# Altium project POWER_SUPPLY.PrjPcb (part 7 of 8)
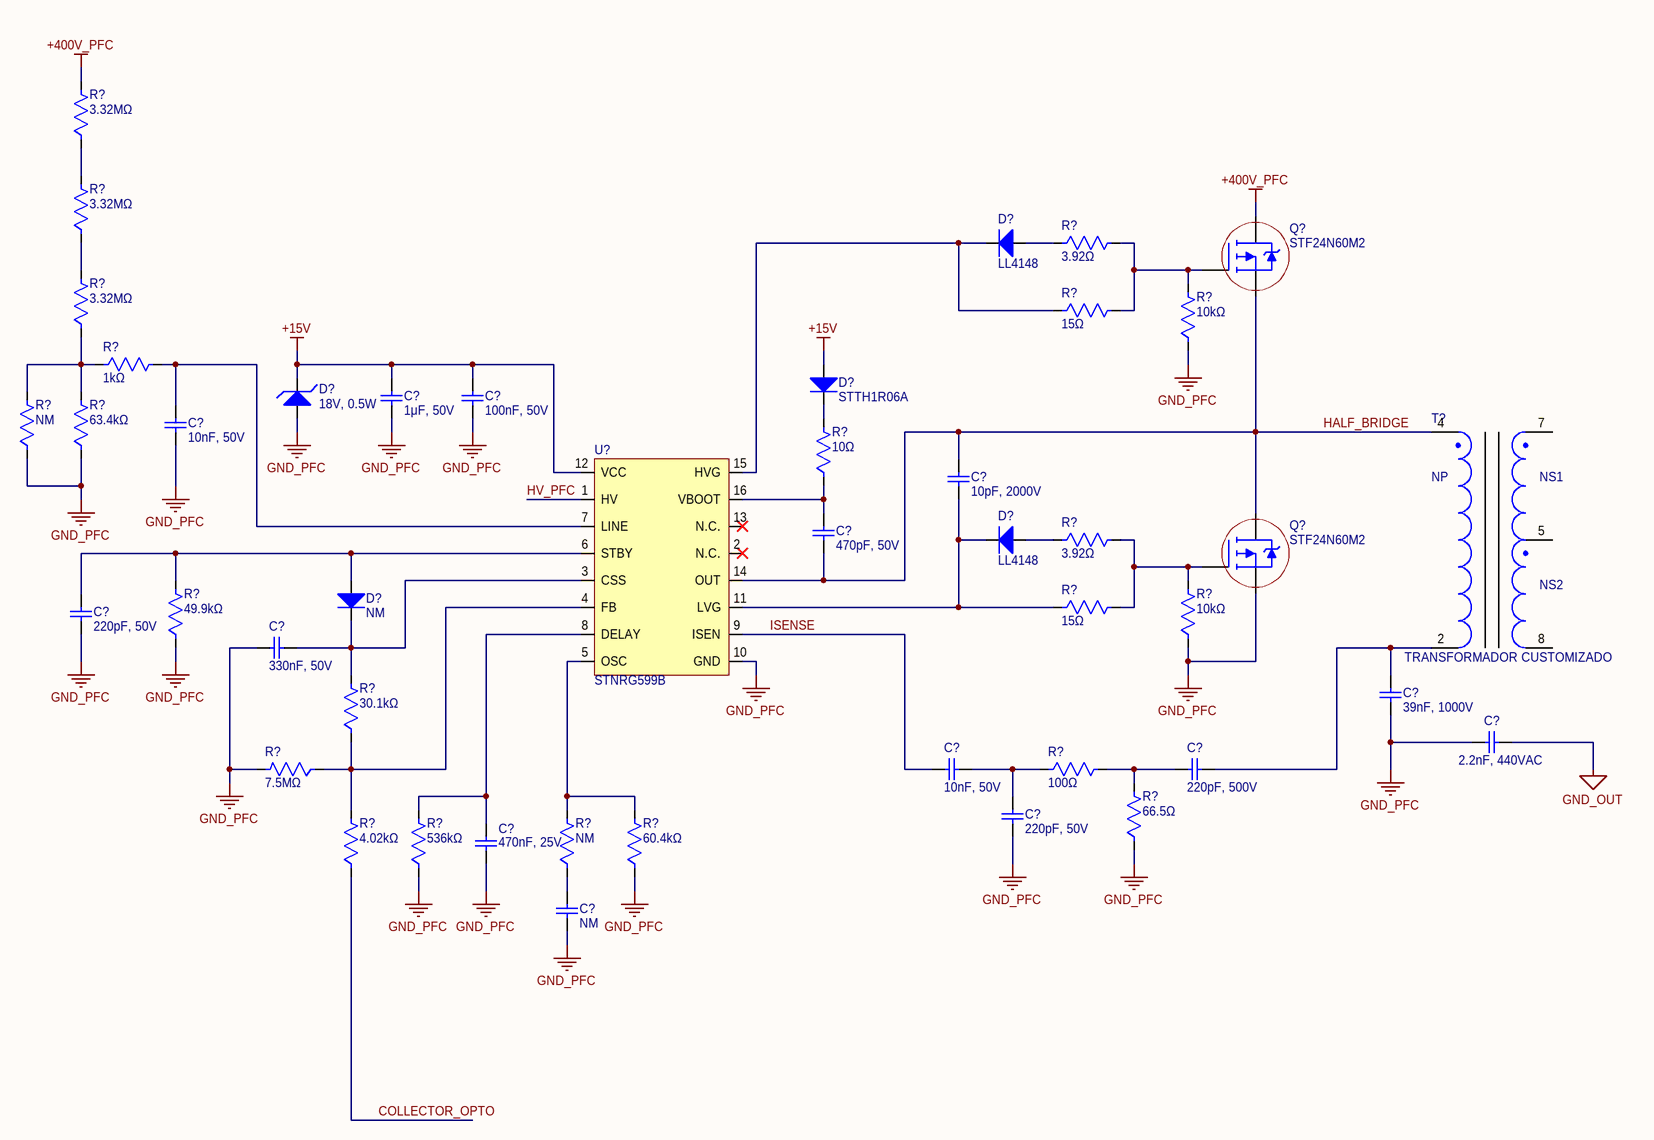
[diagram p8: 3_LLC.SchDoc]

## Sheet 3_LLC.SchDoc (continued)
### Library data of the parts
C?#1 = 885012206126: WCAP-CSGP Multilayer Ceramic Chip Capacitor, General Purpose, size 0603, 1μF, 50V; Manufacturer: Wurth Elektronik; Case/Size Code: 0603; Capacitance Tolerance: +/-10%; Ceramic Type: X7R; Dissipation Factor: 10%; Insulation Resistance: 0.5GΩ; Technical Reference: X7R0603105K050DFCT10000; Manufacturer Part Number: 885012206126; Category: Multilayer Ceramic Chip Capacitors; Match Code: WCAP-CSGP; ComponentLink1Description: Website Link; ComponentLink1URL: https://www.we-online.com/redexpert/article/885012206126?ad; ComponentLink2Description: Datasheet Link; ComponentLink2URL: https://www.we-online.com/redexpert/spec/885012206126?ad; Mount: Surface Mount; Min Operating Temperature: -55°C; Max Operating Temperature: 125°C; Packaging: Tape and Reel; Length: 1.6mm; Width: 0.8mm; Height: 0.8mm; Capacitance: 1μF; Rated Voltage (DC): 50V
C?#2 C?#14 = 885012206095R: WCAP-CSGP Multilayer Ceramic Chip Capacitor, General Purpose, size 0603, 100nF, 50V; Manufacturer: Wurth Elektronik; Case/Size Code: 0603; Capacitance Tolerance: +/-10%; Ceramic Type: X7R; Dissipation Factor: 3%; Insulation Resistance: 5GΩ; Technical Reference: X7R0603104K050DFCT20000; Manufacturer Part Number: 885012206095R; Category: Multilayer Ceramic Chip Capacitors; Match Code: WCAP-CSGP; ComponentLink1Description: Website Link; ComponentLink1URL: https://www.we-online.com/redexpert/article/885012206095R?ad; ComponentLink2Description: Datasheet Link; ComponentLink2URL: https://www.we-online.com/redexpert/spec/885012206095R?ad; Mount: Surface Mount; Min Operating Temperature: -55°C; Max Operating Temperature: 125°C; Packaging: Tape and Reel; Length: 1.6mm; Width: 0.8mm; Height: 0.8mm; Capacitance: 100nF; Rated Voltage (DC): 50V
C?#3 = 885012206089: WCAP-CSGP Multilayer Ceramic Chip Capacitor, General Purpose, size 0603, 10nF, 50V; Manufacturer: Wurth Elektronik; Case/Size Code: 0603; Capacitance Tolerance: +/-10%; Ceramic Type: X7R; Dissipation Factor: 2.5%; Insulation Resistance: 10Gohm; Technical Reference: X7R0603103K050DFCT10000; Manufacturer Part Number: 885012206089; Product Series: WCAP-CSGP; ComponentLink1Description: Website Link; ComponentLink1URL: https://www.we-online.com/redexpert/article/885012206089?ad; ComponentLink2Description: Datasheet Link; ComponentLink2URL: https://www.we-online.com/redexpert/spec/885012206089?ad; Mount: Surface Mount; Operating Temperature Min: -55degC; Operating Temperature Max: 125degC; Packaging: Tape and Reel; Length: 1.6mm; Width: 0.8mm; Height: 0.8mm; Capacitance: 10nF; Rated Voltage (DC): 50V
C?#4 = 885342009004: WCAP-CSMH Multilayer Ceramic Chip Capacitor Mid and High Voltage, SMT, size 1210, NP0 Class I, 10pF, 2000V; Manufacturer: Wurth Elektronik; Case/Size Code: 1210; Capacitance Tolerance: +/-5%; Insulation Resistance: 10Gohm; Q Factor Min: 600; Manufacturer Part Number: 885342009004; Product Series: WCAP-CSMH; ComponentLink1Description: Website Link; ComponentLink1URL: https://www.we-online.com/redexpert/article/885342009004?ad; ComponentLink2Description: Datasheet Link; ComponentLink2URL: https://www.we-online.com/redexpert/spec/885342009004?ad; Mount: Surface Mount; Operating Temperature Min: -55degC; Operating Temperature Max: 125degC; Packaging: Tape and Reel; Length: 3.2mm; Width: 2.5mm; Height: 0.95mm; Capacitance: 10pF; Ceramic Type: NP0 Class I; Rated Voltage (DC): 2000V
C?#5 = 885012006061: WCAP-CSGP Multilayer Ceramic Chip Capacitor, General Purpose, size 0603, 470pF, 50V; Manufacturer: Wurth Elektronik; Case/Size Code: 0603; Capacitance Tolerance: +/-5%; Ceramic Type: NP0; Insulation Resistance: 10Gohm; Q Factor: 1000; Technical Reference: NP00603471J050DFCT10000; Manufacturer Part Number: 885012006061; Product Series: WCAP-CSGP; ComponentLink1Description: Website Link; ComponentLink1URL: https://www.we-online.com/redexpert/article/885012006061?ad; ComponentLink2Description: Datasheet Link; ComponentLink2URL: https://www.we-online.com/redexpert/spec/885012006061?ad; Mount: Surface Mount; Operating Temperature Min: -55degC; Operating Temperature Max: 125degC; Packaging: Tape and Reel; Length: 1.6mm; Width: 0.8mm; Height: 0.8mm; Capacitance: 470pF; Rated Voltage (DC): 50V
C?#6 C?#12 = 885012006059: WCAP-CSGP Multilayer Ceramic Chip Capacitor, General Purpose, size 0603, 220pF, 50V; Manufacturer: Wurth Elektronik; Case/Size Code: 0603; Capacitance Tolerance: +/-5%; Ceramic Type: NP0; Insulation Resistance: 10Gohm; Q Factor: 1000; Technical Reference: NP00603221J050DFCT10000; Manufacturer Part Number: 885012006059; Product Series: WCAP-CSGP; ComponentLink1Description: Website Link; ComponentLink1URL: https://www.we-online.com/redexpert/article/885012006059?ad; ComponentLink2Description: Datasheet Link; ComponentLink2URL: https://www.we-online.com/redexpert/spec/885012006059?ad; Mount: Surface Mount; Operating Temperature Min: -55degC; Operating Temperature Max: 125degC; Packaging: Tape and Reel; Length: 1.6mm; Width: 0.8mm; Height: 0.8mm; Capacitance: 220pF; Rated Voltage (DC): 50V
C?#7 = 885012206121: WCAP-CSGP Multilayer Ceramic Chip Capacitor, General Purpose, size 0603, 330nF, 50V; Manufacturer: Wurth Elektronik; Case/Size Code: 0603; Capacitance Tolerance: +/-10%; Ceramic Type: X7R; Dissipation Factor: 10%; Insulation Resistance: 1.5Gohm; Technical Reference: X7R0603334K050DFCT10000; Manufacturer Part Number: 885012206121; Product Series: WCAP-CSGP; ComponentLink1Description: Website Link; ComponentLink1URL: https://www.we-online.com/redexpert/article/885012206121?ad; ComponentLink2Description: Datasheet Link; ComponentLink2URL: https://www.we-online.com/redexpert/spec/885012206121?ad; Mount: Surface Mount; Operating Temperature Min: -55degC; Operating Temperature Max: 125degC; Packaging: Tape and Reel; Length: 1.6mm; Width: 0.8mm; Height: 0.8mm; Capacitance: 330nF; Rated Voltage (DC): 50V
C?#8 = 76QI2390SE40J: CAP FILM AUTO POLYPROP RAD; Manufacturer: Yageo Group; Dielectric: PP; Dielectric Material: Polypropylene; Lead Diameter: 800µm; Tolerance: 5%; Voltage Rating (AC): 600V; Voltage Rating (DC): 1kV; Supplier: DigiKey; Supplier Part Number: 399-R76QI2390SE40J-ND; Manufacturer Part Number: 76QI2390SE40J; RoHS: Compliant; Category: Film Capacitors; Stock: 469; Pricing: 1=1.27, 10=0.83, 50=0.6542, 100=0.5999, 500=0.5083, 1000=0.47996, 3000=0.44494, 5000=0.43198 (USD); Value: 39nF; Case/Package: Radial; Depth: 8.5mm; Export Control Classification Number (ECCN) Code: EAR99; Height: 14.5mm; Harmonized Tariff Schedule (HTS) Code: 8532.25.00.70; Introduction Date: 2012-07-30; Lead Pitch: 15mm; Length: 18mm; Lifecycle Status: Production; Max Operating Temperature: 110°C; Min Operating Temperature: -55°C; Mounting Technology: Through Hole; Number of Terminals: 2; Packaging: Bulk; Radiation Hardening: No; Ratings: AEC-Q200; REACH SVHC: Unaffected; Terminal Pitch: 15mm; Width: 8.5mm; ComponentLink1URL: https://datasheet.octopart.com:443/76QI2390SE40J-KEMET-datasheet-182036333.pdf?src-supplier=IHS; ComponentLink1Description: https://datasheet.octopart.com:443/76QI2390SE40J-KEMET-datasheet-182036333.pdf?src-supplier=IHS
C?#9 = VY2222M35Y5US63V7: CAP CER 2200PF 440VAC Y5U RADIAL; Manufacturer: Vishay; Dielectric Material: Ceramic; Lead/Base Style: Kinked; Lead Diameter: 600µm; Lead Length: 30mm; Tolerance: 20%; Voltage: 250V; Voltage Rating: 1kV; Voltage Rating (AC): 300V; Supplier: DigiKey; Supplier Part Number: BC2356-ND; Manufacturer Part Number: VY2222M35Y5US63V7; RoHS: Compliant; Category: Ceramic Capacitors; Stock: 12709; Pricing: 1=0.48, 10=0.288, 50=0.2152, 100=0.1928, 500=0.15486, 1000=0.14314, 3000=0.12868, 5000=0.12334 (USD); Value: 2.2nF; Case/Package: Radial; Composition: Ceramic; Contact Plating: Tin; Depth: 5mm; Diameter: 9mm; Dielectric: Y5U; Export Control Classification Number (ECCN) Code: EAR99; Height: 9mm; Height - Seated (Max): 13.0048mm; Harmonized Tariff Schedule (HTS) Code: 8532.23.00.60; Lead Free: Lead Free; Lead Pitch: 7.5mm; Length: 9mm; Lifecycle Status: Production; Material: Ceramic; Max Operating Temperature: 125°C; Min Operating Temperature: -40°C; Mounting Technology: PCB, Through Hole; Number of Terminals: 2; Packaging: Bulk; Radiation Hardening: No; REACH SVHC: Yes; Schedule B: 8532230060, 8532230060|8532230060, 8532230060|8532230060|8532230060, 8532230060|8532230060|8532230060|8532230060; Terminal Pitch: 7.5mm; Termination: Radial; Voltage Rating (DC): 1kV; Width: 5mm; ComponentLink1URL: https://datasheet.octopart.com:443/VY2222M35Y5US63V7-Vishay-datasheet-182139072.pdf?src-supplier=IHS; ComponentLink1Description: https://datasheet.octopart.com:443/VY2222M35Y5US63V7-Vishay-datasheet-182139072.pdf?src-supplier=IHS; ComponentLink2URL: https://datasheet.octopart.com:443/VY2222M35Y5US63V7-Vishay-datasheet-182137621.pdf?src-supplier=IHS; ComponentLink2Description: https://datasheet.octopart.com:443/VY2222M35Y5US63V7-Vishay-datasheet-182137621.pdf?src-supplier=IHS; ComponentLink3URL: https://datasheet.octopart.com:443/VY2222M35Y5US63V7-Vishay-BCcomponents-datasheet-138899136.pdf?src-supplier=Upverter; ComponentLink3Description: https://datasheet.octopart.com:443/VY2222M35Y5US63V7-Vishay-BCcomponents-datasheet-138899136.pdf?src-supplier=Upverter; ComponentLink4URL: https://datasheet.octopart.com:443/VY2222M35Y5US63V7-Vishay-datasheet-62321353.pdf?src-supplier=Farnell; ComponentLink4Description: https://datasheet.octopart.com:443/VY2222M35Y5US63V7-Vishay-datasheet-62321353.pdf?src-supplier=Farnell; ComponentLink5URL: https://datasheet.octopart.com:443/VY2222M35Y5US63V7-Vishay-datasheet-15070738.pdf?src-supplier=Farnell; ComponentLink5Description: https://datasheet.octopart.com:443/VY2222M35Y5US63V7-Vishay-datasheet-15070738.pdf?src-supplier=Farnell; ComponentLink6URL: https://datasheet.octopart.com:443/VY2222M35Y5US63V7-Vishay-datasheet-10380040.pdf?src-supplier=element14+APAC; ComponentLink6Description: https://datasheet.octopart.com:443/VY2222M35Y5US63V7-Vishay-datasheet-10380040.pdf?src-supplier=element14+APAC; ComponentLink7URL: https://datasheet.octopart.com:443/VY2222M35Y5US63V7-Vishay-datasheet-13530909.pdf?src-supplier=Future+Electronics; ComponentLink7Description: https://datasheet.octopart.com:443/VY2222M35Y5US63V7-Vishay-datasheet-13530909.pdf?src-supplier=Future+Electronics; ComponentLink8URL: https://datasheet.octopart.com:443/VY2222M35Y5US63V7-Vishay-datasheet-13402494.pdf?src-supplier=Future+Electronics; ComponentLink8Description: https://datasheet.octopart.com:443/VY2222M35Y5US63V7-Vishay-datasheet-13402494.pdf?src-supplier=Future+Electronics; ComponentLink9URL: https://datasheet.octopart.com:443/VY2222M35Y5US63V7-Vishay-datasheet-13168647.pdf?src-supplier=Future+Electronics; ComponentLink9Description: https://datasheet.octopart.com:443/VY2222M35Y5US63V7-Vishay-datasheet-13168647.pdf?src-supplier=Future+Electronics; ComponentLink10URL: https://datasheet.octopart.com:443/VY2222M35Y5US63V7-Vishay-datasheet-13030022.pdf?src-supplier=Future+Electronics; ComponentLink10Description: https://datasheet.octopart.com:443/VY2222M35Y5US63V7-Vishay-datasheet-13030022.pdf?src-supplier=Future+Electronics; ComponentLink11URL: https://datasheet.octopart.com:443/VY2222M35Y5US63V7-Vishay-datasheet-12553972.pdf?src-supplier=Future+Electronics; ComponentLink11Description: https://datasheet.octopart.com:443/VY2222M35Y5US63V7-Vishay-datasheet-12553972.pdf?src-supplier=Future+Electronics; ComponentLink12URL: https://datasheet.octopart.com:443/VY2222M35Y5US63V7-Vishay-datasheet-12524127.pdf?src-supplier=Future+Electronics; ComponentLink12Description: https://datasheet.octopart.com:443/VY2222M35Y5US63V7-Vishay-datasheet-12524127.pdf?src-supplier=Future+Electronics; ComponentLink13URL: https://datasheet.octopart.com:443/VY2222M35Y5US63V7-Vishay-datasheet-12510687.pdf?src-supplier=Future+Electronics; ComponentLink13Description: https://datasheet.octopart.com:443/VY2222M35Y5US63V7-Vishay-datasheet-12510687.pdf?src-supplier=Future+Electronics; ComponentLink14URL: https://datasheet.octopart.com:443/VY2222M35Y5US63V7-Vishay-datasheet-27584505.pdf?src-supplier=Future+Electronics; ComponentLink14Description: https://datasheet.octopart.com:443/VY2222M35Y5US63V7-Vishay-datasheet-27584505.pdf?src-supplier=Future+Electronics; ComponentLink15URL: https://datasheet.octopart.com:443/VY2222M35Y5US63V7-Vishay-datasheet-9918016.pdf?src-supplier=RS+(Formerly+Allied+Electronics); ComponentLink15Description: https://datasheet.octopart.com:443/VY2222M35Y5US63V7-Vishay-datasheet-9918016.pdf?src-supplier=RS+(Formerly+Allied+Electronics); ComponentLink16URL: http://sigma.octopart.com:80/rohs_statement/Vishay-company-15.pdf?src-supplier=Compliance+Statements; ComponentLink16Description: http://sigma.octopart.com:80/rohs_statement/Vishay-company-15.pdf?src-supplier=Compliance+Statements
C?#10 = 885012207092: WCAP-CSGP Multilayer Ceramic Chip Capacitor, General Purpose, size 0805, 10nF, 50V; Manufacturer: Wurth Elektronik; Case/Size Code: 0805; Capacitance Tolerance: +/-10%; Ceramic Type: X7R; Dissipation Factor: 2.5%; Insulation Resistance: 10Gohm; Technical Reference: X7R0805103K050DFCT10000; Manufacturer Part Number: 885012207092; Product Series: WCAP-CSGP; ComponentLink1Description: Website Link; ComponentLink1URL: https://www.we-online.com/redexpert/article/885012207092?ad; ComponentLink2Description: Datasheet Link; ComponentLink2URL: https://www.we-online.com/redexpert/spec/885012207092?ad; Mount: Surface Mount; Operating Temperature Min: -55degC; Operating Temperature Max: 125degC; Packaging: Tape and Reel; Length: 2mm; Width: 1.25mm; Height: 0.8mm; Capacitance: 10nF; Rated Voltage (DC): 50V
C?#11 = 885342008002: WCAP-CSMH Multilayer Ceramic Chip Capacitor Mid and High Voltage, SMT, size 1206, NP0 Class I, 220pF, 500V; Manufacturer: Wurth Elektronik; Case/Size Code: 1206; Capacitance Tolerance: +/-5%; Insulation Resistance: 10Gohm; Q Factor Min: 1000; Manufacturer Part Number: 885342008002; Product Series: WCAP-CSMH; ComponentLink1Description: Website Link; ComponentLink1URL: https://www.we-online.com/redexpert/article/885342008002?ad; ComponentLink2Description: Datasheet Link; ComponentLink2URL: https://www.we-online.com/redexpert/spec/885342008002?ad; Mount: Surface Mount; Operating Temperature Min: -55degC; Operating Temperature Max: 125degC; Packaging: Tape and Reel; Length: 3.2mm; Width: 1.6mm; Height: 0.8mm; Capacitance: 220pF; Ceramic Type: NP0 Class I; Rated Voltage (DC): 500V
C?#13 = 885012206075: WCAP-CSGP Multilayer Ceramic Chip Capacitor, General Purpose, size 0603, 470nF, 25V; Manufacturer: Wurth Elektronik; Case/Size Code: 0603; Capacitance Tolerance: +/-10%; Ceramic Type: X7R; Dissipation Factor: 10%; Insulation Resistance: 1.1Gohm; Technical Reference: X7R0603474K025DFCT10000; Manufacturer Part Number: 885012206075; Product Series: WCAP-CSGP; ComponentLink1Description: Website Link; ComponentLink1URL: https://www.we-online.com/redexpert/article/885012206075?ad; ComponentLink2Description: Datasheet Link; ComponentLink2URL: https://www.we-online.com/redexpert/spec/885012206075?ad; Mount: Surface Mount; Operating Temperature Min: -55degC; Operating Temperature Max: 125degC; Packaging: Tape and Reel; Length: 1.6mm; Width: 0.8mm; Height: 0.8mm; Capacitance: 470nF; Rated Voltage (DC): 25V
D?#1 D?#4 D?#5 = LL4148: DIODE STANDARD 100V 200MA SOD80; Manufacturer: onsemi; Manufacturer Lifecycle Status: ACTIVE; Body Material: Glass; Current: 2A; Element Configuration: Single; Forward Voltage: 1V; Max Power Dissipation: 500mW; Number of Elements: 1; Peak Reverse Current: 25nA; Recovery Time: 4ns; Supplier: DigiKey; Supplier Part Number: LL4148FSCT-ND; Manufacturer Part Number: LL4148; RoHS: Compliant; Category: Rectifier Diodes; Stock: 985538; Pricing: 1=0.1, 10=0.05, 100=0.0426, 500=0.0307, 1000=0.02682 (USD); Average Rectified Current: 200mA; China RoHS: Non-Compliant; Contact Plating: Tin; Country of Origin: Mainland China; Export Control Classification Number (ECCN) Code: EAR99; Forward Current: 200mA; Height: 1.5mm; Harmonized Tariff Schedule (HTS) Code: 8541.10.00.70; Introduction Date: 2006-01-13; Lead Free: Lead Free; Length: 3.6mm; Lifecycle Status: Production; Max Forward Surge Current (Ifsm): 2A; Max Operating Temperature: 175°C; Max Output current: 200mA; Max Repetitive Reverse Voltage (Vrrm): 100V; Max Reverse Voltage (DC): 100V; Max Surge Current: 2A; Min Operating Temperature: -55°C; Mounting Technology: Surface Mount; Pins: 2; Number of Terminals: 2; Packaging: Cut Tape; Peak Non-Repetitive Surge Current: 2A; Power Dissipation: 500mW; Radiation Hardening: No; REACH SVHC: Yes; Reverse Recovery Time: 4ns; Reverse Standoff Voltage: 100V; Reverse Voltage: 100V; Schedule B: 8541100070, 8541100070|8541100070, 8541100070|8541100070|8541100070, 8541100070|8541100070|8541100070|8541100070; Voltage: 100V; Weight: 4.535924g; Width: 1.5mm; ComponentLink1URL: https://datasheet.octopart.com:443/LL4148-onsemi-datasheet-158584874.pdf?src-supplier=onsemi; ComponentLink1Description: https://datasheet.octopart.com:443/LL4148-onsemi-datasheet-158584874.pdf?src-supplier=onsemi; ComponentLink2URL: https://datasheet.octopart.com:443/LL4148-ON-Semiconductor-datasheet-85572496.pdf?src-supplier=onsemi; ComponentLink2Description: https://datasheet.octopart.com:443/LL4148-ON-Semiconductor-datasheet-85572496.pdf?src-supplier=onsemi; ComponentLink3URL: https://datasheet.octopart.com:443/LL4148-ON-Semiconductor-datasheet-86697764.pdf?src-supplier=onsemi; ComponentLink3Description: https://datasheet.octopart.com:443/LL4148-ON-Semiconductor-datasheet-86697764.pdf?src-supplier=onsemi; ComponentLink4URL: https://datasheet.octopart.com:443/LL4148-ON-Semiconductor-datasheet-17172799.pdf?src-supplier=element14+APAC; ComponentLink4Description: https://datasheet.octopart.com:443/LL4148-ON-Semiconductor-datasheet-17172799.pdf?src-supplier=element14+APAC; ComponentLink5URL: https://datasheet.octopart.com:443/LL4148-ON-Semiconductor-datasheet-86691521.pdf?src-supplier=element14+APAC; ComponentLink5Description: https://datasheet.octopart.com:443/LL4148-ON-Semiconductor-datasheet-86691521.pdf?src-supplier=element14+APAC; ComponentLink6URL: https://datasheet.octopart.com:443/LL4148-Fairchild-Semiconductor-datasheet-38581097.pdf?src-supplier=element14+APAC; ComponentLink6Description: https://datasheet.octopart.com:443/LL4148-Fairchild-Semiconductor-datasheet-38581097.pdf?src-supplier=element14+APAC; ComponentLink7URL: https://datasheet.octopart.com:443/LL4148-Fairchild-Semiconductor-datasheet-62114946.pdf?src-supplier=element14+APAC; ComponentLink7Description: https://datasheet.octopart.com:443/LL4148-Fairchild-Semiconductor-datasheet-62114946.pdf?src-supplier=element14+APAC; ComponentLink8URL: https://datasheet.octopart.com:443/LL4148-Fairchild-Semiconductor-datasheet-62292353.pdf?src-supplier=element14+APAC; ComponentLink8Description: https://datasheet.octopart.com:443/LL4148-Fairchild-Semiconductor-datasheet-62292353.pdf?src-supplier=element14+APAC; ComponentLink9URL: https://datasheet.octopart.com:443/LL4148.-ON-Semiconductor-datasheet-87455466.pdf?src-supplier=element14+APAC; ComponentLink9Description: https://datasheet.octopart.com:443/LL4148.-ON-Semiconductor-datasheet-87455466.pdf?src-supplier=element14+APAC; ComponentLink10URL: https://datasheet.octopart.com:443/LL4148-ON-Semiconductor-datasheet-100088444.pdf?src-supplier=JRH+Electronics; ComponentLink10Description: https://datasheet.octopart.com:443/LL4148-ON-Semiconductor-datasheet-100088444.pdf?src-supplier=JRH+Electronics; ComponentLink11URL: https://datasheet.octopart.com:443/LL4148-onsemi-datasheet-180961323.pdf?src-supplier=IHS; ComponentLink11Description: https://datasheet.octopart.com:443/LL4148-onsemi-datasheet-180961323.pdf?src-supplier=IHS; ComponentLink12URL: https://datasheet.octopart.com:443/LL4148-Fairchild-Semiconductor-datasheet-182297807.pdf?src-supplier=IHS; ComponentLink12Description: https://datasheet.octopart.com:443/LL4148-Fairchild-Semiconductor-datasheet-182297807.pdf?src-supplier=IHS; ComponentLink13URL: https://datasheet.octopart.com:443/LL4148-Fairchild-datasheet-492438.pdf?src-supplier=Fairchild+Semiconductor; ComponentLink13Description: https://datasheet.octopart.com:443/LL4148-Fairchild-datasheet-492438.pdf?src-supplier=Fairchild+Semiconductor; ComponentLink14URL: https://datasheet.octopart.com:443/LL4148-Fairchild-Semiconductor-datasheet-11045226.pdf?src-supplier=Fairchild+Semiconductor; ComponentLink14Description: https://datasheet.octopart.com:443/LL4148-Fairchild-Semiconductor-datasheet-11045226.pdf?src-supplier=Fairchild+Semiconductor; ComponentLink15URL: https://sigma.octopart.com:443/17344539/technical_drawing/Fairchild-Semiconductor-LL4148.pdf?src-supplier=Fairchild+Semiconductor; ComponentLink15Description: https://sigma.octopart.com:443/17344539/technical_drawing/Fairchild-Semiconductor-LL4148.pdf?src-supplier=Fairchild+Semiconductor; ComponentLink16URL: https://datasheet.octopart.com:443/LL4148-Fairchild-Semiconductor-datasheet-14041796.pdf?src-supplier=iiiC; ComponentLink16Description: https://datasheet.octopart.com:443/LL4148-Fairchild-Semiconductor-datasheet-14041796.pdf?src-supplier=iiiC; ComponentLink17URL: https://datasheet.octopart.com:443/LL4148-Fairchild-Semiconductor-datasheet-10438456.pdf?src-supplier=Jameco; ComponentLink17Description: https://datasheet.octopart.com:443/LL4148-Fairchild-Semiconductor-datasheet-10438456.pdf?src-supplier=Jameco; ComponentLink18URL: https://datasheet.octopart.com:443/LL4148-ON-Semiconductor-datasheet-81454985.pdf?src-supplier=TME; ComponentLink18Description: https://datasheet.octopart.com:443/LL4148-ON-Semiconductor-datasheet-81454985.pdf?src-supplier=TME; ComponentLink19URL: https://datasheet.octopart.com:443/LL4148-Fairchild-Semiconductor-datasheet-62139678.pdf?src-supplier=iodParts+Technologies+Inc.; ComponentLink19Description: https://datasheet.octopart.com:443/LL4148-Fairchild-Semiconductor-datasheet-62139678.pdf?src-supplier=iodParts+Technologies+Inc.; ComponentLink20URL: https://datasheet.octopart.com:443/LL4148-Fairchild-Semiconductor-datasheet-62268912.pdf?src-supplier=Newark; ComponentLink20Description: https://datasheet.octopart.com:443/LL4148-Fairchild-Semiconductor-datasheet-62268912.pdf?src-supplier=Newark; ComponentLink21URL: http://sigma.octopart.com:80/150613095/rohs_statement/ON-Semiconductor-LL4148.pdf?src-supplier=Compliance+Statements; ComponentLink21Description: http://sigma.octopart.com:80/150613095/rohs_statement/ON-Semiconductor-LL4148.pdf?src-supplier=Compliance+Statements; ComponentLink22URL: http://sigma.octopart.com:80/17353531/reach_statement/Fairchild-Semiconductor-LL4148.pdf?src-supplier=Compliance+Statements; ComponentLink22Description: http://sigma.octopart.com:80/17353531/reach_statement/Fairchild-Semiconductor-LL4148.pdf?src-supplier=Compliance+Statements; ComponentLink23URL: http://sigma.octopart.com:80/17353532/materials_sheet/Fairchild-Semiconductor-LL4148.pdf?src-supplier=Compliance+Statements; ComponentLink23Description: http://sigma.octopart.com:80/17353532/materials_sheet/Fairchild-Semiconductor-LL4148.pdf?src-supplier=Compliance+Statements; ComponentLink24URL: http://sigma.octopart.com:80/33193297/reach_statement/Fairchild-Semiconductor-LL4148.pdf?src-supplier=Compliance+Statements; ComponentLink24Description: http://sigma.octopart.com:80/33193297/reach_statement/Fairchild-Semiconductor-LL4148.pdf?src-supplier=Compliance+Statements; ComponentLink25URL: http://sigma.octopart.com:80/33193298/materials_sheet/Fairchild-Semiconductor-LL4148.pdf?src-supplier=Compliance+Statements; ComponentLink25Description: http://sigma.octopart.com:80/33193298/materials_sheet/Fairchild-Semiconductor-LL4148.pdf?src-supplier=Compliance+Statements; ComponentLink26URL: http://sigma.octopart.com:80/reach_statement/ON-Semiconductor-company-79.pdf?src-supplier=Compliance+Statements; ComponentLink26Description: http://sigma.octopart.com:80/reach_statement/ON-Semiconductor-company-79.pdf?src-supplier=Compliance+Statements; ComponentLink27URL: http://sigma.octopart.com:80/rohs_statement/Fairchild-Semiconductor-company-11.pdf?src-supplier=Compliance+Statements; ComponentLink27Description: http://sigma.octopart.com:80/rohs_statement/Fairchild-Semiconductor-company-11.pdf?src-supplier=Compliance+Statements; ComponentLink28URL: http://sigma.octopart.com:80/rohs_statement/Fairchild-Semiconductor-company-10.pdf?src-supplier=Compliance+Statements; ComponentLink28Description: http://sigma.octopart.com:80/rohs_statement/Fairchild-Semiconductor-company-10.pdf?src-supplier=Compliance+Statements; ComponentLink29URL: http://sigma.octopart.com:80/reach_statement/Fairchild-Semiconductor-company-9.pdf?src-supplier=Compliance+Statements; ComponentLink29Description: http://sigma.octopart.com:80/reach_statement/Fairchild-Semiconductor-company-9.pdf?src-supplier=Compliance+Statements; ComponentLink30URL: https://octopart.com:443/opatz8j6/c1?t=Xpxkz2NEgx4OvPA3Qtyl6iXlCaTO6Dx006tOayOQh8UpEakiw79qybXVjaLUkLdsDcwAhzZWzx4hsVWPp7VVSRUS2jTBS-XM3DH5FBRSfylGBMniz7AQVr_Q7R3Jx2l4jaOKMfh2pC0Sl6mKcG5iyxqYHFtscphSICSNicIjKzxGRZvfLlKmxXOW-H294Yk1x_cmMiAGYKmeAx8dFNplOshOoCdbbUeOktIk3E71qjxJoHCVKROfEgPEuVAOotDk7D3GLFhb0ONIF7lvGKCN4-I4pNAMnSjDC8dGdI9FUWqMmgWXOVngnCQl4h9fXjZD62hPSik3c7L-oytIjEzlRkn8LqxphGg_pA&src-supplier=Compliance+Statements; ComponentLink30Description: https://octopart.com:443/opatz8j6/c1?t=Xpxkz2NEgx4OvPA3Qtyl6iXlCaTO6Dx006tOayOQh8UpEakiw79qybXVjaLUkLdsDcwAhzZWzx4hsVWPp7VVSRUS2jTBS-XM3DH5FBRSfylGBMniz7AQVr_Q7R3Jx2l4jaOKMfh2pC0Sl6mKcG5iyxqYHFtscphSICSNicIjKzxGRZvfLlKmxXOW-H294Yk1x_cmMiAGYKmeAx8dFNplOshOoCdbbUeOktIk3E71qjxJoHCVKROfEgPEuVAOotDk7D3GLFhb0ONIF7lvGKCN4-I4pNAMnSjDC8dGdI9FUWqMmgWXOVngnCQl4h9fXjZD62hPSik3c7L-oytIjEzlRkn8LqxphGg_pA&src-supplier=Compliance+Statements; ComponentLink31URL: https://octopart.com:443/opatz8j6/c1?t=tFIoAttQBStIyOR12NpmeKiMmTe5SP8-8Xq4lkvK6p_Vq1o_9olfxB33t-2EuHG15KFq_ggm6QlYiEY221wMJCkD3umFHElGgHs0hHZS39-Qp2ZZRsupO9Hr1N3PAdDpe750FQU0XgmhgEwHMZn8Z3k5HuoWmRNpRKEnkRFrE0IXKj6CmvQTfQmsENA-D1Qdyo8uqC6uxEsjmMW0Z_q8gXSjLM0_5fRz8eR6DFUS172wwd2S-tXcH_fY0j82uyAjy2XTX7JZakjtcfcCauvyxulJf2m4Pvazm22R5r_wpz6eRhj7z7PQ5lP7HSMDztpbFG7UgPSC_-QkyDNCFsHVILyjtZbhab6GOQU&src-supplier=Compliance+Statements; ComponentLink31Description: https://octopart.com:443/opatz8j6/c1?t=tFIoAttQBStIyOR12NpmeKiMmTe5SP8-8Xq4lkvK6p_Vq1o_9olfxB33t-2EuHG15KFq_ggm6QlYiEY221wMJCkD3umFHElGgHs0hHZS39-Qp2ZZRsupO9Hr1N3PAdDpe750FQU0XgmhgEwHMZn8Z3k5HuoWmRNpRKEnkRFrE0IXKj6CmvQTfQmsENA-D1Qdyo8uqC6uxEsjmMW0Z_q8gXSjLM0_5fRz8eR6DFUS172wwd2S-tXcH_fY0j82uyAjy2XTX7JZakjtcfcCauvyxulJf2m4Pvazm22R5r_wpz6eRhj7z7PQ5lP7HSMDztpbFG7UgPSC_-QkyDNCFsHVILyjtZbhab6GOQU&src-supplier=Compliance+Statements
D?#2 = STTH1R06A: DIODE STANDARD 600V 1A SMA; Manufacturer: STMicroelectronics; Element Configuration: Single; Forward Voltage: 1.25V; Max Forward Surge Current (Ifsm): 20A; Max Junction Temperature (Tj): 175°C; Natural Thermal Resistance: 30°C/W; Number of Elements: 1; Peak Reverse Current: 1µA; Recovery Time: 45ns; Reverse Recovery Time: 25ns; RMS Current (Irms): 7A; Supplier: DigiKey; Supplier Part Number: 497-3765-1-ND; Manufacturer Part Number: STTH1R06A; RoHS: Compliant; Category: Rectifier Diodes; Stock: 189763; Pricing: 1=0.91, 10=0.562, 50=0.4118, 100=0.3631, 500=0.2772 (USD); Average Rectified Current: 1A; Case/Package: SMA; China RoHS: Non-Compliant; Contact Plating: Tin; Country of Origin: Mainland China; Current Rating: 1A; Export Control Classification Number (ECCN) Code: EAR99; Forward Current: 1A; Height: 2.03mm; Harmonized Tariff Schedule (HTS) Code: 8541.10.00.80; Introduction Date: 1980-01-04; Lead Free: Lead Free; Length: 4.6mm; Lifecycle Status: Production; Max Operating Temperature: 175°C; Max Output current: 1A; Max Repetitive Reverse Voltage (Vrrm): 600V; Max Reverse Voltage (DC): 600V; Max Surge Current: 20A; Min Operating Temperature: -65°C; Mounting Technology: Surface Mount; Pins: 2; Number of Terminals: 2; Output Current: 1A; Packaging: Tape and Reel; Peak Non-Repetitive Surge Current: 20A; Polarity: Standard; Radiation Hardening: No; REACH SVHC: Affected; Reverse Standoff Voltage: 600V; Reverse Voltage: 600V; Schedule B: 8541100080, 8541100080|8541100080|8541100080|8541100080|8541100080; Termination: SMD/SMT; Voltage Rating (DC): 600V; Weight: 45.359237g; Width: 2.95mm; ComponentLink1URL: https://datasheet.octopart.com:443/STTH1R06A-STMicroelectronics-datasheet-12531819.pdf?src-supplier=Upverter; ComponentLink1Description: https://datasheet.octopart.com:443/STTH1R06A-STMicroelectronics-datasheet-12531819.pdf?src-supplier=Upverter; ComponentLink2URL: https://datasheet.octopart.com:443/STTH1R06A-STMicroelectronics-datasheet-8398447.pdf?src-supplier=element14+APAC; ComponentLink2Description: https://datasheet.octopart.com:443/STTH1R06A-STMicroelectronics-datasheet-8398447.pdf?src-supplier=element14+APAC; ComponentLink3URL: https://datasheet.octopart.com:443/STTH1R06A-STMicroelectronics-datasheet-7628442.pdf?src-supplier=Farnell; ComponentLink3Description: https://datasheet.octopart.com:443/STTH1R06A-STMicroelectronics-datasheet-7628442.pdf?src-supplier=Farnell; ComponentLink4URL: https://datasheet.octopart.com:443/STTH1R06A-STMicroelectronics-datasheet-14054158.pdf?src-supplier=iiiC; ComponentLink4Description: https://datasheet.octopart.com:443/STTH1R06A-STMicroelectronics-datasheet-14054158.pdf?src-supplier=iiiC; ComponentLink5URL: https://datasheet.octopart.com:443/STTH1R06A-STMicroelectronics-datasheet-6005.pdf?src-supplier=DigiKey; ComponentLink5Description: https://datasheet.octopart.com:443/STTH1R06A-STMicroelectronics-datasheet-6005.pdf?src-supplier=DigiKey
D?#3 = ZMM18B: DIODE ZENER 18V 500MW SOD80C; Manufacturer: Diotec; Manufacturer Lifecycle Status: ACTIVE; Body Material: Glass; Impedance: 50Ω; Number of Elements: 1; Peak Reverse Current: 100nA; Polarity: Unidirectional; Reverse Standoff Voltage: 13V; Voltage Tolerance: 2%; Zener Current: 5mA; Supplier: DigiKey; Supplier Part Number: 4878-ZMM18B-ND; Manufacturer Part Number: ZMM18B; RoHS: Compliant; Category: Zener Diodes; Stock: 2500; Pricing: 1=0.18, 10=0.108, 100=0.0823, 500=0.07154, 1000=0.042, 2500=0.04116 (USD); Country of Origin: Mainland China; Export Control Classification Number (ECCN) Code: EAR99; Harmonized Tariff Schedule (HTS) Code: 85411000; Introduction Date: 2005-07-18; Lifecycle Status: Production; Max Operating Temperature: 175°C; Max Power Dissipation: 500mW; Min Operating Temperature: -50°C; Number of Terminals: 2; REACH SVHC: Unknown; Reference Voltage: 18V; Weight: 49mg; ComponentLink1URL: https://datasheet.octopart.com:443/ZMM18B-Diotec-datasheet-168810322.pdf?src-supplier=IHS; ComponentLink1Description: https://datasheet.octopart.com:443/ZMM18B-Diotec-datasheet-168810322.pdf?src-supplier=IHS; ComponentLink2URL: https://datasheet.octopart.com:443/ZMM18B-Diotec-datasheet-20772213.pdf?src-supplier=Component+Distributors+Inc.; ComponentLink2Description: https://datasheet.octopart.com:443/ZMM18B-Diotec-datasheet-20772213.pdf?src-supplier=Component+Distributors+Inc.; ComponentLink3URL: https://datasheet.octopart.com:443/ZMM18B-Diotec-datasheet-113245526.pdf?src-supplier=TME; ComponentLink3Description: https://datasheet.octopart.com:443/ZMM18B-Diotec-datasheet-113245526.pdf?src-supplier=TME; ComponentLink4URL: https://datasheet.octopart.com:443/ZMM18B-Diotec-datasheet-177062540.pdf?src-supplier=Burklin+Elektronik; ComponentLink4Description: https://datasheet.octopart.com:443/ZMM18B-Diotec-datasheet-177062540.pdf?src-supplier=Burklin+Elektronik
Q?#1 Q?#2 = STF24N60M2: MOSFET N-CH 600V 18A TO220FP; Manufacturer: STMicroelectronics; Drain to Source Resistance: 190mΩ; Element Configuration: Single; Fall Time: 61ns; Gate to Source Voltage (Vgs): 25V; Input Capacitance: 1.06nF; Max Power Dissipation: 30W; Number of Elements: 1; Rise Time: 9ns; Turn-Off Delay Time: 60ns; Turn-On Delay Time: 14ns; Supplier: DigiKey; Supplier Part Number: 497-13577-5-ND; Manufacturer Part Number: STF24N60M2; RoHS: Compliant; Category: MOSFETs; Stock: 871; Pricing: 1=3.33, 50=1.6716, 100=1.5103, 500=1.22756, 1000=1.13672, 2000=1.06037, 5000=1.05788 (USD); Case/Package: TO-220-3; China RoHS: Non-Compliant; Continuous Drain Current (ID): 18A; Country of Origin: Mainland China; Drain to Source Breakdown Voltage: 600V; Drain to Source Voltage (Vdss): 600V; Export Control Classification Number (ECCN) Code: EAR99; Height: 16.4mm; Introduction Date: 2013-01-14; Lead Free: Lead Free; Length: 10.4mm; Lifecycle Status: Production; Max Operating Temperature: 150°C; Min Breakdown Voltage: 600V; Min Operating Temperature: -55°C; Mounting Technology: Through Hole; Pins: 3; Number of Terminals: 3; Power Dissipation: 30W; Radiation Hardening: No; Rds On Max: 190mΩ; REACH SVHC: No; Schedule B: 8541290080, 8541290080|8541290080|8541290080|8541290080|8541290080|8541290080|8541290080|8541290080|8541290080|8541290080|8541290080|8541290080|8541290080|8541290080|8541290080|8541290080|8541290080|8541290080|8541290080|8541290080|8541290080|8541290080|8541290080|85; Width: 4.6mm; ComponentLink1URL: https://datasheet.octopart.com:443/STF24N60M2-STMicroelectronics-datasheet-62336145.pdf?src-supplier=Farnell; ComponentLink1Description: https://datasheet.octopart.com:443/STF24N60M2-STMicroelectronics-datasheet-62336145.pdf?src-supplier=Farnell; ComponentLink2URL: https://datasheet.octopart.com:443/STF24N60M2-STMicroelectronics-datasheet-16349054.pdf?src-supplier=Future+Electronics; ComponentLink2Description: https://datasheet.octopart.com:443/STF24N60M2-STMicroelectronics-datasheet-16349054.pdf?src-supplier=Future+Electronics; ComponentLink3URL: https://datasheet.octopart.com:443/STF24N60M2-STMicroelectronics-datasheet-62335173.pdf?src-supplier=TME; ComponentLink3Description: https://datasheet.octopart.com:443/STF24N60M2-STMicroelectronics-datasheet-62335173.pdf?src-supplier=TME
R?#1 R?#2 R?#5 = RC1206FR-073M32L: RES 3.32M OHM 1% 1/4W 1206; Manufacturer: Yageo Group; Max Power Dissipation: 250mW; Temperature Coefficient: 100ppm/°C; Voltage Rating: 200V; Supplier: DigiKey; Supplier Part Number: 311-3.32MFRCT-ND; Manufacturer Part Number: RC1206FR-073M32L; RoHS: Compliant; Category: Chip SMD Resistors; Pricing: 1=0.1, 10=0.047, 25=0.036, 50=0.0296, 100=0.0247, 250=0.0198, 500=0.01698, 1000=0.01477 (USD); Case/Package: 1206; Case Code (Imperial): 1206; Case Code (Metric): 3216; China RoHS: Non-Compliant; Composition: Thick Film; Contact Plating: Tin; Country of Origin: Mainland China, Taiwan; Export Control Classification Number (ECCN) Code: EAR99; Features: Moisture Resistant; Height: 550µm; Harmonized Tariff Schedule (HTS) Code: 8533.21.00.30; Introduction Date: 2004-09-22; Lead Free: Lead Free; Length: 3.1mm; Lifecycle Status: Production; Max Operating Temperature: 155°C; Min Operating Temperature: -55°C; Mounting Technology: Surface Mount; Number of Terminals: 2; Number of Terminations: 2; Power Rating: 250mW; Radiation Hardening: No; REACH SVHC: Unaffected; Value: 3.32MΩ; Schedule B: 8533210045, 8533210045|8533210045|8533210045|8533210045|8533210045; Termination: SMD/SMT; Tolerance: 1%; Voltage Rating (DC): 200V; Width: 1.6mm; Working Voltage: 200V; ComponentLink1URL: https://datasheet.octopart.com:443/RC1206FR-073M32L-Yageo-datasheet-175887523.pdf?src-supplier=IHS; ComponentLink1Description: https://datasheet.octopart.com:443/RC1206FR-073M32L-Yageo-datasheet-175887523.pdf?src-supplier=IHS; ComponentLink2URL: https://datasheet.octopart.com:443/RC1206FR-073M32L-Yageo-datasheet-103092701.pdf?src-supplier=Upverter; ComponentLink2Description: https://datasheet.octopart.com:443/RC1206FR-073M32L-Yageo-datasheet-103092701.pdf?src-supplier=Upverter; ComponentLink3URL: https://datasheet.octopart.com:443/RC1206FR-073M32L-Yageo-Group-datasheet-176638170.pdf?src-supplier=Future+Electronics; ComponentLink3Description: https://datasheet.octopart.com:443/RC1206FR-073M32L-Yageo-Group-datasheet-176638170.pdf?src-supplier=Future+Electronics; ComponentLink4URL: https://datasheet.octopart.com:443/RC1206FR-073M32L-Yageo-datasheet-164759695.pdf?src-supplier=Future+Electronics; ComponentLink4Description: https://datasheet.octopart.com:443/RC1206FR-073M32L-Yageo-datasheet-164759695.pdf?src-supplier=Future+Electronics; ComponentLink5URL: https://datasheet.octopart.com/RC1206FR-073M32L-Yageo-datasheet-73766026.pdf; ComponentLink5Description: https://datasheet.octopart.com/RC1206FR-073M32L-Yageo-datasheet-73766026.pdf; ComponentLink6URL: https://datasheet.octopart.com:443/RC1206FR-073M32L-Yageo-datasheet-118639.pdf?src-supplier=DigiKey; ComponentLink6Description: https://datasheet.octopart.com:443/RC1206FR-073M32L-Yageo-datasheet-118639.pdf?src-supplier=DigiKey; ComponentLink7URL: http://sigma.octopart.com:80/conflict_mineral_statement/Yageo-company-3.pdf?src-supplier=Compliance+Statements; ComponentLink7Description: http://sigma.octopart.com:80/conflict_mineral_statement/Yageo-company-3.pdf?src-supplier=Compliance+Statements; ComponentLink8URL: http://sigma.octopart.com:80/rohs_statement/Yageo-company-2.pdf?src-supplier=Compliance+Statements; ComponentLink8Description: http://sigma.octopart.com:80/rohs_statement/Yageo-company-2.pdf?src-supplier=Compliance+Statements
R?#3 R?#11 = RC0805FR-073R92L: RES 3.92 OHM 1% 1/8W 0805; Manufacturer: Yageo Group; Manufacturer Package Identifier: 0805 (2012 metric); Max Power Dissipation: 125mW; Temperature Coefficient: 200ppm/°C; Voltage Rating: 150V; Supplier: DigiKey; Supplier Part Number: 311-3.92CRCT-ND; Manufacturer Part Number: RC0805FR-073R92L; RoHS: Compliant; Category: Chip SMD Resistors; Stock: 8839; Pricing: 1=0.1, 10=0.015, 25=0.0148 (USD); Case/Package: 0805; Case Code (Imperial): 0805; China RoHS: Non-Compliant; Composition: Thick Film; Contact Plating: Tin; Depth: 1.25mm; Features: Moisture Resistant; Height: 500µm; Lead Free: Lead Free; Length: 2mm; Lifecycle Status: Production; Max Operating Temperature: 155°C; Military Standard: Not; Min Operating Temperature: -55°C; Mounting Technology: Surface Mount; Number of Terminals: 2; Number of Terminations: 2; Power Dissipation: 125mW; Power Rating: 125mW; Radiation Hardening: No; REACH SVHC: Yes; Value: 3.92Ω; Schedule B: 8533210045, 8533210045|8533210045|8533210045|8533210045|8533210045; Termination: SMD/SMT; Tolerance: 1%; Voltage Rating (DC): 150V; Width: 1.25mm; Working Voltage: 150V; ComponentLink1URL: https://datasheet.octopart.com:443/RC0805FR-073R92L-Yageo-datasheet-175887523.pdf?src-supplier=IHS; ComponentLink1Description: https://datasheet.octopart.com:443/RC0805FR-073R92L-Yageo-datasheet-175887523.pdf?src-supplier=IHS; ComponentLink2URL: https://datasheet.octopart.com:443/RC0805FR-073R92L-Yageo-datasheet-103092701.pdf?src-supplier=Upverter; ComponentLink2Description: https://datasheet.octopart.com:443/RC0805FR-073R92L-Yageo-datasheet-103092701.pdf?src-supplier=Upverter; ComponentLink3URL: https://datasheet.octopart.com:443/RC0805FR-073R92L-Yageo-Group-datasheet-176638170.pdf?src-supplier=Future+Electronics; ComponentLink3Description: https://datasheet.octopart.com:443/RC0805FR-073R92L-Yageo-Group-datasheet-176638170.pdf?src-supplier=Future+Electronics; ComponentLink4URL: https://datasheet.octopart.com:443/RC0805FR-073R92L-Yageo-datasheet-164759695.pdf?src-supplier=Future+Electronics; ComponentLink4Description: https://datasheet.octopart.com:443/RC0805FR-073R92L-Yageo-datasheet-164759695.pdf?src-supplier=Future+Electronics; ComponentLink5URL: https://datasheet.octopart.com:443/RC0805FR-073R92L-Yageo-datasheet-12592811.pdf?src-supplier=Future+Electronics; ComponentLink5Description: https://datasheet.octopart.com:443/RC0805FR-073R92L-Yageo-datasheet-12592811.pdf?src-supplier=Future+Electronics; ComponentLink6URL: https://datasheet.octopart.com:443/RC0805FR-073R92L-Yageo-datasheet-8330313.pdf?src-supplier=Future+Electronics; ComponentLink6Description: https://datasheet.octopart.com:443/RC0805FR-073R92L-Yageo-datasheet-8330313.pdf?src-supplier=Future+Electronics; ComponentLink7URL: https://datasheet.octopart.com:443/RC0805FR-073R92L-Yageo-datasheet-8324252.pdf?src-supplier=Future+Electronics; ComponentLink7Description: https://datasheet.octopart.com:443/RC0805FR-073R92L-Yageo-datasheet-8324252.pdf?src-supplier=Future+Electronics; ComponentLink8URL: https://datasheet.octopart.com/RC0805FR-073R92L-Yageo-datasheet-73766026.pdf; ComponentLink8Description: https://datasheet.octopart.com/RC0805FR-073R92L-Yageo-datasheet-73766026.pdf; ComponentLink9URL: https://datasheet.octopart.com:443/RC0805FR-073R92L-Yageo-datasheet-118657.pdf?src-supplier=DigiKey; ComponentLink9Description: https://datasheet.octopart.com:443/RC0805FR-073R92L-Yageo-datasheet-118657.pdf?src-supplier=DigiKey; ComponentLink10URL: http://sigma.octopart.com:80/conflict_mineral_statement/Yageo-company-3.pdf?src-supplier=Compliance+Statements; ComponentLink10Description: http://sigma.octopart.com:80/conflict_mineral_statement/Yageo-company-3.pdf?src-supplier=Compliance+Statements; ComponentLink11URL: http://sigma.octopart.com:80/rohs_statement/Yageo-company-2.pdf?src-supplier=Compliance+Statements; ComponentLink11Description: http://sigma.octopart.com:80/rohs_statement/Yageo-company-2.pdf?src-supplier=Compliance+Statements
R?#4 R?#12 = RC0805FR-0715RL: RES 15 OHM 1% 1/8W 0805; Manufacturer: Yageo Group; Max Power Dissipation: 125mW; Temperature Coefficient: 100ppm/°C; Voltage Rating: 150V; Supplier: DigiKey; Supplier Part Number: 311-15.0CRCT-ND; Manufacturer Part Number: RC0805FR-0715RL; RoHS: Compliant; Category: Chip SMD Resistors; Stock: 34767; Pricing: 1=0.13, 10=0.010, 25=0.0096, 50=0.0092, 100=0.0083 (USD); Case/Package: 0805; Case Code (Imperial): 0805; China RoHS: Non-Compliant; Composition: Thick Film; Country of Origin: Mainland China, Taiwan; Depth: 1.25mm; Export Control Classification Number (ECCN) Code: EAR99; Features: Moisture Resistant; Height: 500µm; Harmonized Tariff Schedule (HTS) Code: 8533.21.00.30; Introduction Date: 2004-09-22; Lead Free: Lead Free; Length: 2mm; Lifecycle Status: Production; Max Operating Temperature: 155°C; Military Standard: Not; Min Operating Temperature: -55°C; Mounting Technology: Surface Mount; Pins: 2; Number of Terminals: 2; Number of Terminations: 2; Power Dissipation: 125mW; Power Rating: 125mW; REACH SVHC: Yes; Value: 15Ω; Schedule B: 8533210045, 8533210045|8533210045, 8533210045|8533210045|8533210045, 8533210045|8533210045|8533210045|8533210045; Termination: SMD/SMT; Tolerance: 1%; Voltage Rating (AC): 150V; Voltage Rating (DC): 150V; Width: 1.25mm; Working Voltage: 150V; ComponentLink1URL: https://datasheet.octopart.com:443/RC0805FR-0715RL-Yageo-datasheet-175887523.pdf?src-supplier=Newark; ComponentLink1Description: https://datasheet.octopart.com:443/RC0805FR-0715RL-Yageo-datasheet-175887523.pdf?src-supplier=Newark; ComponentLink2URL: https://datasheet.octopart.com:443/RC0805FR-0715RL-Yageo-datasheet-103092701.pdf?src-supplier=Upverter; ComponentLink2Description: https://datasheet.octopart.com:443/RC0805FR-0715RL-Yageo-datasheet-103092701.pdf?src-supplier=Upverter; ComponentLink3URL: https://datasheet.octopart.com:443/RC0805FR-0715RL-Yageo-Group-datasheet-190305687.pdf?src-supplier=Future+Electronics; ComponentLink3Description: https://datasheet.octopart.com:443/RC0805FR-0715RL-Yageo-Group-datasheet-190305687.pdf?src-supplier=Future+Electronics; ComponentLink4URL: https://datasheet.octopart.com:443/RC0805FR-0715RL-Yageo-datasheet-164759695.pdf?src-supplier=Future+Electronics; ComponentLink4Description: https://datasheet.octopart.com:443/RC0805FR-0715RL-Yageo-datasheet-164759695.pdf?src-supplier=Future+Electronics; ComponentLink5URL: https://datasheet.octopart.com:443/RC0805FR-0715RL-Yageo-datasheet-127823281.pdf?src-supplier=Future+Electronics; ComponentLink5Description: https://datasheet.octopart.com:443/RC0805FR-0715RL-Yageo-datasheet-127823281.pdf?src-supplier=Future+Electronics; ComponentLink6URL: https://datasheet.octopart.com:443/RC0805FR-0715RL-Yageo-datasheet-137700087.pdf?src-supplier=Future+Electronics; ComponentLink6Description: https://datasheet.octopart.com:443/RC0805FR-0715RL-Yageo-datasheet-137700087.pdf?src-supplier=Future+Electronics; ComponentLink7URL: https://datasheet.octopart.com:443/RC0805FR-0715RL-Yageo-datasheet-12592811.pdf?src-supplier=Future+Electronics; ComponentLink7Description: https://datasheet.octopart.com:443/RC0805FR-0715RL-Yageo-datasheet-12592811.pdf?src-supplier=Future+Electronics; ComponentLink8URL: https://datasheet.octopart.com:443/RC0805FR-0715RL-Yageo-datasheet-8324252.pdf?src-supplier=Future+Electronics; ComponentLink8Description: https://datasheet.octopart.com:443/RC0805FR-0715RL-Yageo-datasheet-8324252.pdf?src-supplier=Future+Electronics; ComponentLink9URL: https://datasheet.octopart.com:443/RC0805FR-0715RL-Yageo-datasheet-8330313.pdf?src-supplier=element14+APAC; ComponentLink9Description: https://datasheet.octopart.com:443/RC0805FR-0715RL-Yageo-datasheet-8330313.pdf?src-supplier=element14+APAC; ComponentLink10URL: https://datasheet.octopart.com:443/RC0805FR-0715RL-Yageo-datasheet-62067350.pdf?src-supplier=element14+APAC; ComponentLink10Description: https://datasheet.octopart.com:443/RC0805FR-0715RL-Yageo-datasheet-62067350.pdf?src-supplier=element14+APAC; ComponentLink11URL: https://datasheet.octopart.com:443/RC0805FR-0715RL-Yageo-datasheet-148775077.pdf?src-supplier=TME; ComponentLink11Description: https://datasheet.octopart.com:443/RC0805FR-0715RL-Yageo-datasheet-148775077.pdf?src-supplier=TME; ComponentLink12URL: https://datasheet.octopart.com/RC0805FR-0715RL-Yageo-datasheet-73766026.pdf; ComponentLink12Description: https://datasheet.octopart.com/RC0805FR-0715RL-Yageo-datasheet-73766026.pdf; ComponentLink13URL: https://datasheet.octopart.com:443/RC0805FR-0715RL-Yageo-datasheet-13691069.pdf?src-supplier=Farnell; ComponentLink13Description: https://datasheet.octopart.com:443/RC0805FR-0715RL-Yageo-datasheet-13691069.pdf?src-supplier=Farnell; ComponentLink14URL: https://datasheet.octopart.com:443/RC0805FR-0715RL-Yageo-datasheet-118657.pdf?src-supplier=DigiKey; ComponentLink14Description: https://datasheet.octopart.com:443/RC0805FR-0715RL-Yageo-datasheet-118657.pdf?src-supplier=DigiKey; ComponentLink15URL: http://sigma.octopart.com:80/conflict_mineral_statement/Yageo-company-3.pdf?src-supplier=Compliance+Statements; ComponentLink15Description: http://sigma.octopart.com:80/conflict_mineral_statement/Yageo-company-3.pdf?src-supplier=Compliance+Statements; ComponentLink16URL: http://sigma.octopart.com:80/rohs_statement/Yageo-company-2.pdf?src-supplier=Compliance+Statements; ComponentLink16Description: http://sigma.octopart.com:80/rohs_statement/Yageo-company-2.pdf?src-supplier=Compliance+Statements